# EAGLE schematic groundhog-thr-REVA (EAGLE 6.5.0)
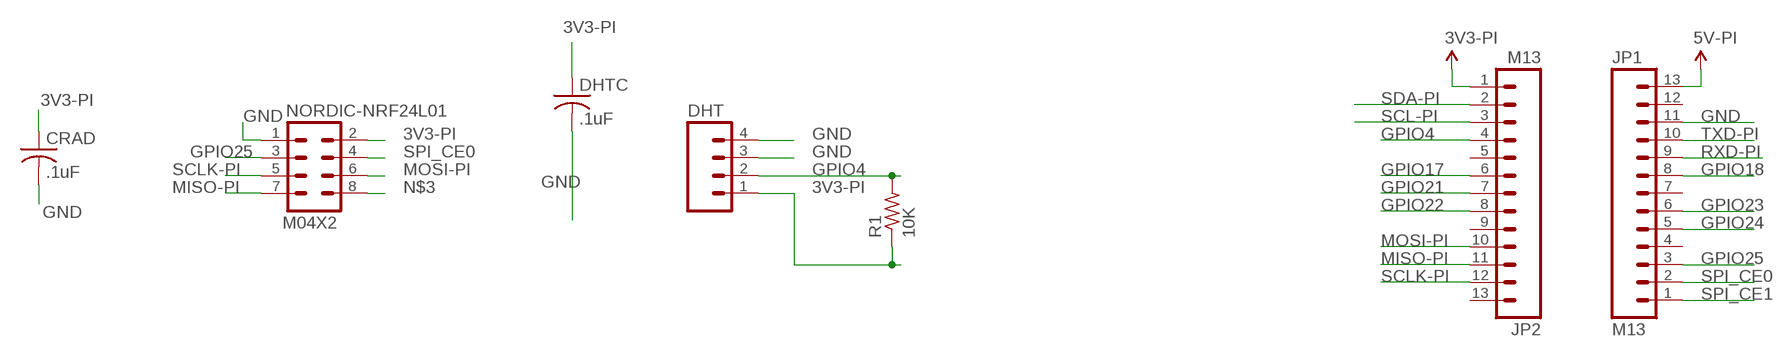
[diagram p0: schematic, sheet 1]

## Parts
CRAD  .1uF  C-USC0805  [C0805]
DHT  M04PTH  [1X04]
DHTC  .1uF  C-USC0805  [C0805]
JP1  M13  [1X13]
JP2  M13  [1X13]
NORDIC-NRF24L01  M04X2  [2X4]
R1  10K  R-US_R0805  [R0805]

## Nets
3V3-PI [3V3-PI]: CRAD.1 DHT.1 DHTC.1 JP2.1 NORDIC-NRF24L01.2 R1.1
5V-PI [5V-PI]: JP1.13
GND [GND]: CRAD.2 DHT.3 DHT.4 DHTC.2 JP1.11 NORDIC-NRF24L01.1
GPIO4: DHT.2 JP2.4 R1.2
GPIO17: JP2.6
GPIO18: JP1.8
GPIO21: JP2.7
GPIO22: JP2.8
GPIO23: JP1.6
GPIO24: JP1.5
GPIO25: JP1.3 NORDIC-NRF24L01.3
MISO-PI: JP2.11 NORDIC-NRF24L01.7
MOSI-PI: JP2.10 NORDIC-NRF24L01.6
N$3: NORDIC-NRF24L01.8
RXD-PI: JP1.9
SCL-PI: JP2.3
SCLK-PI: JP2.12 NORDIC-NRF24L01.5
SDA-PI: JP2.2
SPI_CE0: JP1.2 NORDIC-NRF24L01.4
SPI_CE1: JP1.1
TXD-PI: JP1.10
Unconnected: JP1.4 JP1.7 JP1.12 JP2.5 JP2.9 JP2.13

## Library data of the parts
CRAD DHTC = adafruit:C-US: CAPACITOR, American symbol
DHT = SparkFun-Connectors:M04: Header 4 Standard 4-pin 0.1" header. Use with straight break away headers (SKU : PRT-00116), right angle break away headers (PRT-00553), swiss pins (PRT-00743), machine pins (PRT-00117), and female headers (PRT-00115). Molex polarized connector foot print use with SKU : PRT-08231 with associated crimp pins and housings. 1MM SMD Version SKU: PRT-10208
JP1 JP2 = SparkFun-Connectors:M13: 13-pin single row .1" header
NORDIC-NRF24L01 = SparkFun-Connectors:M04X2: .1" header, two rows of four.
R1 = adafruit:R-US_: RESISTOR, American symbol

## Net classes
0 Default: width 0.203 mm
1 GND: width 0.203 mm, drill 0.305 mm, clearance 0.152 mm
3 3V3-PI: width 0.203 mm, drill 0.305 mm, clearance 0.152 mm
4 5V-PI: width 0.203 mm, drill 0.305 mm, clearance 0.152 mm